# EAGLE schematic GridInverter (EAGLE 6.5.0)
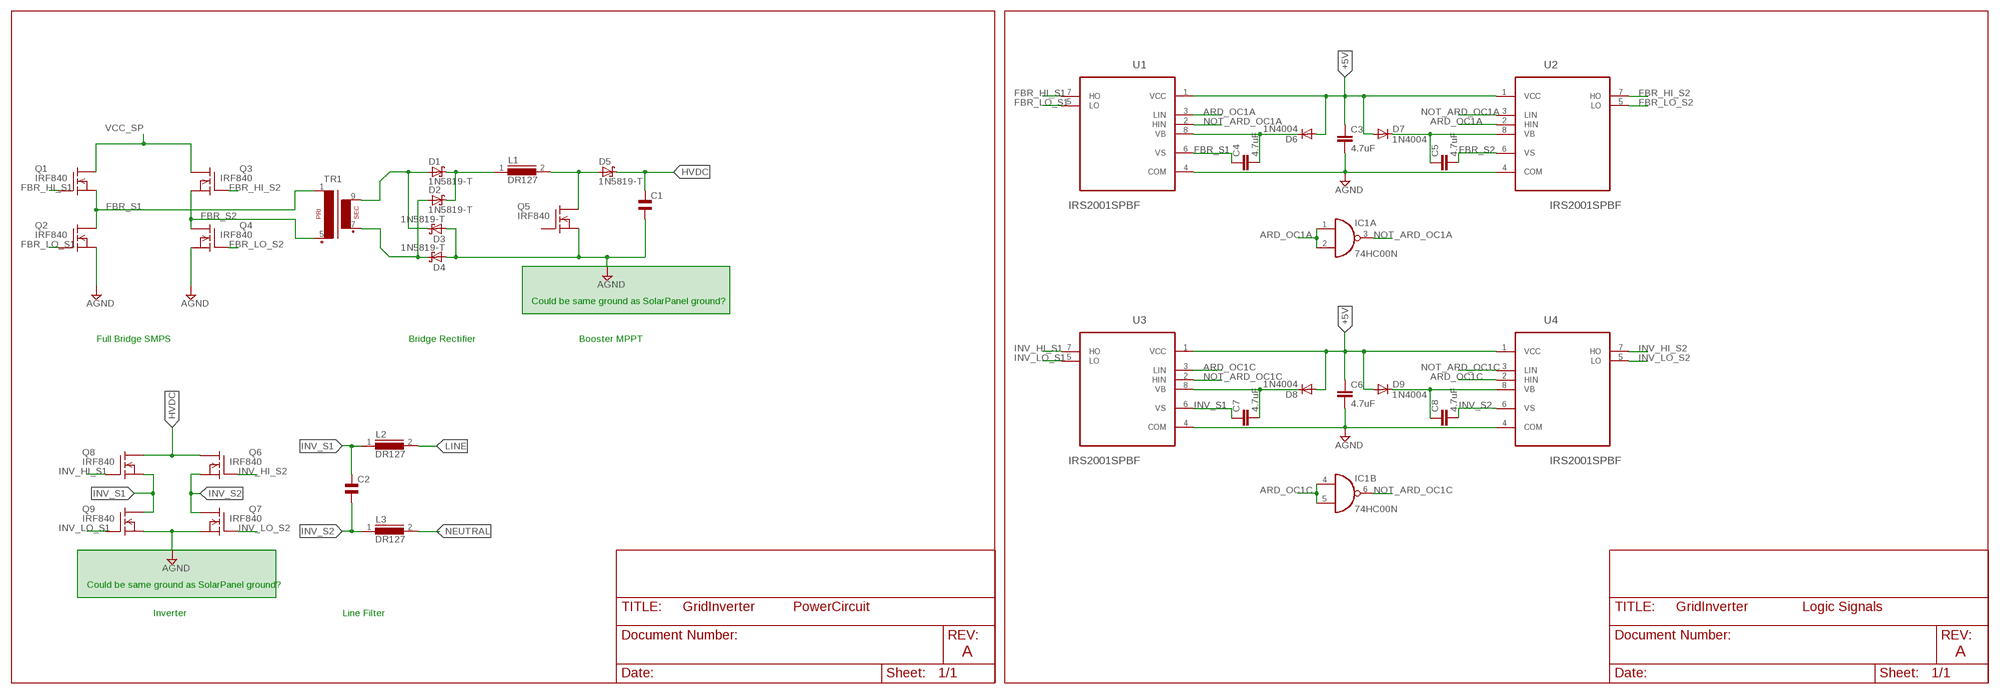
[diagram p0: schematic, sheet 1]

## Parts
C1  EL-BI45-18AXIAL  [EU45-18]
C2  EL-BI45-18AXIAL  [EU45-18]
C3  4.7uF  4.7UF-16V-20%,+80%-(1206)  [1206-CAP]
C4  4.7uF  4.7UF-16V-20%,+80%-(1206)  [1206-CAP]
C5  4.7uF  4.7UF-16V-20%,+80%-(1206)  [1206-CAP]
C6  4.7uF  4.7UF-16V-20%,+80%-(1206)  [1206-CAP]
C7  4.7uF  4.7UF-16V-20%,+80%-(1206)  [1206-CAP]
C8  4.7uF  4.7UF-16V-20%,+80%-(1206)  [1206-CAP]
D1  1N5819-T  [DO41-7.6]
D2  1N5819-T  [DO41-7.6]
D3  1N5819-T  [DO41-7.6]
D4  1N5819-T  [DO41-7.6]
D5  1N5819-T  [DO41-7.6]
D6  1N4004  [DO41-10]
D7  1N4004  [DO41-10]
D8  1N4004  [DO41-10]
D9  1N4004  [DO41-10]
IC1  74HC00N  [DIL14]
L1  DR127  [DR127]
L2  DR127  [DR127]
L3  DR127  [DR127]
Q1  IRF840  [TO220]
Q2  IRF840  [TO220]
Q3  IRF840  [TO220]
Q4  IRF840  [TO220]
Q5  IRF840  [TO220]
Q6  IRF840  [TO220]
Q7  IRF840  [TO220]
Q8  IRF840  [TO220]
Q9  IRF840  [TO220]
TR1  VR11  [VR11]
U1  IRS2001SPBF  [SOIC127P600X175-8N]
U2  IRS2001SPBF  [SOIC127P600X175-8N]
U3  IRS2001SPBF  [SOIC127P600X175-8N]
U4  IRS2001SPBF  [SOIC127P600X175-8N]

## Nets
+5V: C3.1 C6.1 D6.A D7.A D8.A D9.A U1.1(VCC) U2.1(VCC) U3.1(VCC) U4.1(VCC)
AGND: C1.2 C3.2 C6.2 D3.A D4.A Q2.3(S) Q4.3(S) Q5.3(S) Q7.3(S) Q9.3(S) U1.4(COM) U2.4(COM) U3.4(COM) U4.4(COM)
ARD_OC1A: IC1.1(A:I0) IC1.2(A:I1) U1.3(LIN) U2.2(HIN)
ARD_OC1C: IC1.4(B:I0) IC1.5(B:I1) U3.3(LIN) U4.2(HIN)
FBR_HI_S1: Q1.1(G) U1.7(HO)
FBR_HI_S2: Q3.1(G) U2.7(HO)
FBR_LO_S1: Q2.1(G) U1.5(LO)
FBR_LO_S2: Q4.1(G) U2.5(LO)
FBR_S1: C4.1 Q1.3(S) Q2.2(D) TR1.1 U1.6(VS)
FBR_S2: C5.2 Q3.3(S) Q4.2(D) TR1.5(P2) U2.6(VS)
HVDC: C1.1 D5.C Q6.2(D) Q8.2(D)
INV_HI_S1: Q8.1(G) U3.7(HO)
INV_HI_S2: Q6.1(G) U4.7(HO)
INV_LO_S1: Q9.1(G) U3.5(LO)
INV_LO_S2: Q7.1(G) U4.5(LO)
INV_S1: C2.1 C7.1 L2.1 Q8.3(S) Q9.2(D) U3.6(VS)
INV_S2: C2.2 C8.2 L3.1 Q6.3(S) Q7.2(D) U4.6(VS)
LINE: L2.2
N$1: C7.2 D8.C U3.8(VB)
N$2: C8.1 D9.C U4.8(VB)
N$4: D5.A L1.2 Q5.2(D)
N$6: D1.C D2.C L1.1
N$11: C4.2 D6.C U1.8(VB)
N$12: C5.1 D7.C U2.8(VB)
NEUTRAL: L3.2
NOT_ARD_OC1A: IC1.3(A:O) U1.2(HIN) U2.3(LIN)
NOT_ARD_OC1C: IC1.6(B:O) U3.2(HIN) U4.3(LIN)
S+: D1.A D3.C TR1.9(S4)
S-: D2.A D4.C TR1.7(S3)
VCC_SP: Q1.2(D) Q3.2(D)
Unconnected: IC1.8(C:O) IC1.9(C:I0) IC1.10(C:I1) IC1.11(D:O) IC1.12(D:I0) IC1.13(D:I1) Q5.1(G)

## Notes on the sheet
- Could be same ground as SolarPanel ground?
- Full Bridge SMPS | Bridge Rectifier | Booster MPPT
- Could be same ground as SolarPanel ground?
- PowerCircuit | Logic Signals
- Inverter | Line Filter
- A | A

## Power pins joined to a net without a drawn wire
GND: IC1.7(P:GND)
VCC: IC1.14(P:VCC)

## Library data of the parts
C1 C2 = rcl:EL-: BIPOLAR ELECTROLYTIC CAPACITOR
C3-C8 = SparkFun-Capacitors:4.7UF-16V-20%,+80%-(1206): CAP-10300; PROD_ID: CAP-10300
D1-D5 = diode:1N581*: 1.0A SCHOTTKY BARRIER RECTIFIER Source: http://www.diodes.com/datasheets/ds23001.pdf
D6-D9 = diode:1N4004: DIODE general purpose rectifier, 1 A
IC1 = 74xx-eu:74*00: Quad 2-input NAND gate
L1-L3 = inductors:DR127: High Power Density, High Efficiency, Shielded Inductors Source: coiltronics_dr_series.pdf
Q1-Q9 = transistor-fet:IRF840: N-Channel Enhancement MOSFET (HEXFET); 500V; 8A; 0,85Ohm
TR1 = trafo:VR11: TRANSFORMER 1 primary winding, 1 secondary winding BLOCK
U1-U4 = International_Rectifier_By_element14_Batch_1:IRS2001SPBF: HIGH AND LOW SIDE DRIVER; MPN: IRS2001SPBF; OC_FARNELL: 1603666; OC_NEWARK: 21M6577; PACKAGE: SOIC-8; SUPPLIER: INTERNATIONAL RECTIFIER